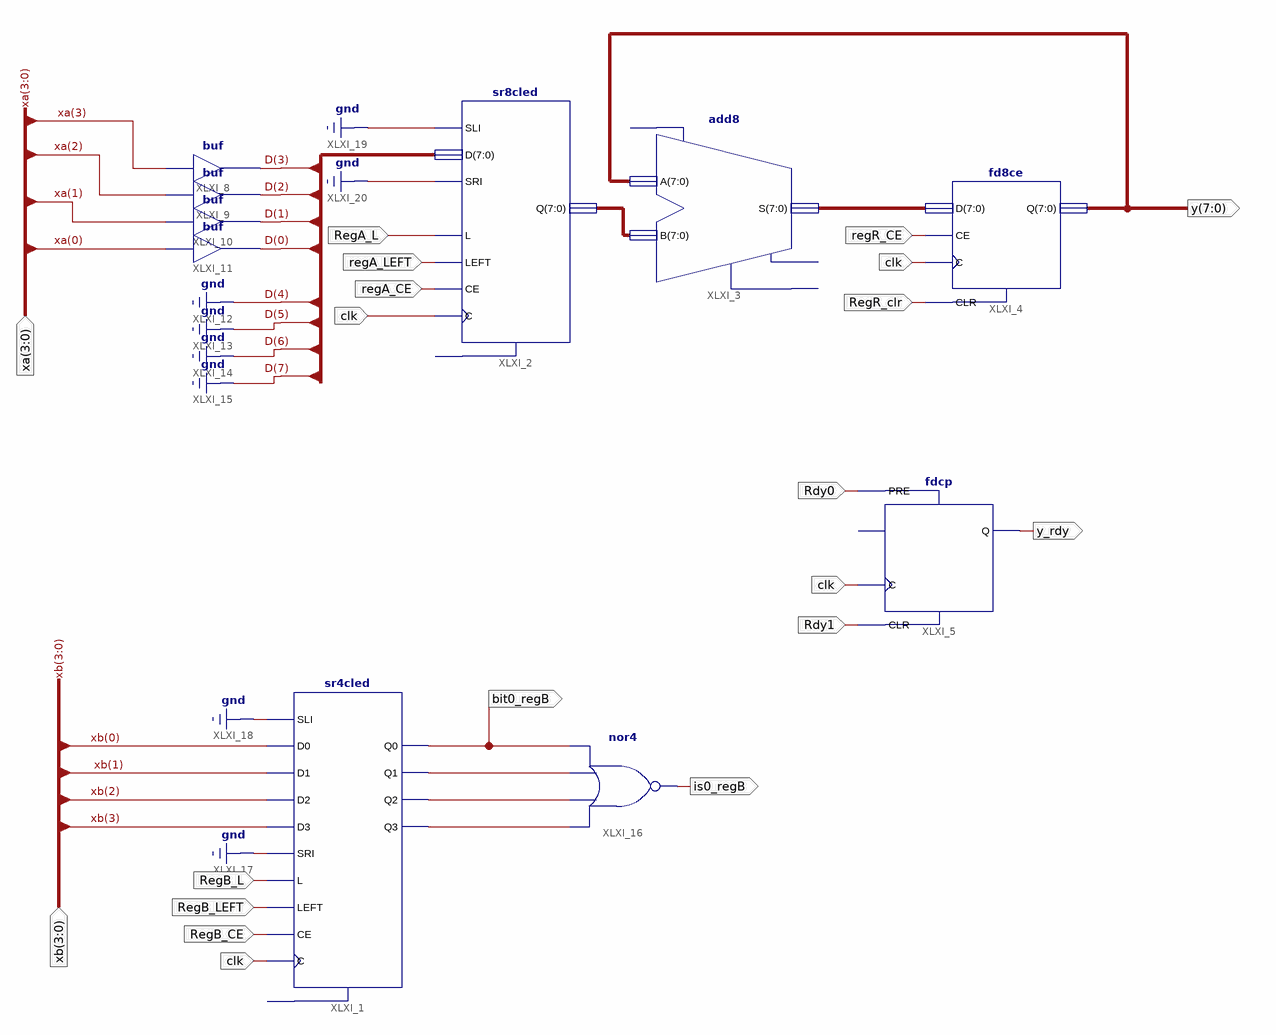
[diagram p0: schematic sheet 1]
// Xilinx ISE schematic taskC.sch (spartan3a) as structural Verilog: 10 symbols, 17 ports
module taskC (
  input  [3:0] xa,
  input  [3:0] xb,
  input  regR_CE,
  input  clk,
  input  RegB_CE,
  input  RegB_L,
  input  Rdy0,
  input  Rdy1,
  input  RegA_L,
  input  RegR_clr,
  input  RegB_LEFT,
  input  regA_LEFT,
  input  regA_CE,
  output [7:0] y,
  output bit0_regB,
  output is0_regB,
  output y_rdy
);

  wire XLXN_52, XLXN_53, XLXN_54;
  wire [3:0] D;
  wire [7:0] XLXN_38, XLXN_39;

  sr4cled XLXI_1 (
    .C(clk), .CE(RegB_CE), .D0(xb[0]), .D1(xb[1]), .D2(xb[2]), .D3(xb[3]), .L(RegB_L), .LEFT(RegB_LEFT),
    .SLI(1'b0), .SRI(1'b0), .Q0(bit0_regB), .Q1(XLXN_52), .Q2(XLXN_53), .Q3(XLXN_54));  // open: CLR
  add8 XLXI_3 (.A(y), .B(XLXN_38), .S(XLXN_39));  // open: CI, CO, OFL
  fd8ce XLXI_4 (.C(clk), .CE(regR_CE), .CLR(RegR_clr), .D(XLXN_39), .Q(y));
  fdcp XLXI_5 (.C(clk), .CLR(Rdy1), .PRE(Rdy0), .Q(y_rdy));  // open: D
  sr8cled XLXI_2 (
    .C(clk), .CE(regA_CE), .D({4'b0000, D}), .L(RegA_L), .LEFT(regA_LEFT), .SLI(1'b0), .SRI(1'b0), .Q(XLXN_38));  // open: CLR
  buf XLXI_8 (D[3], xa[3]);
  buf XLXI_9 (D[2], xa[2]);
  buf XLXI_10 (D[1], xa[1]);
  buf XLXI_11 (D[0], xa[0]);
  nor XLXI_16 (is0_regB, XLXN_54, XLXN_53, XLXN_52, bit0_regB);
endmodule
